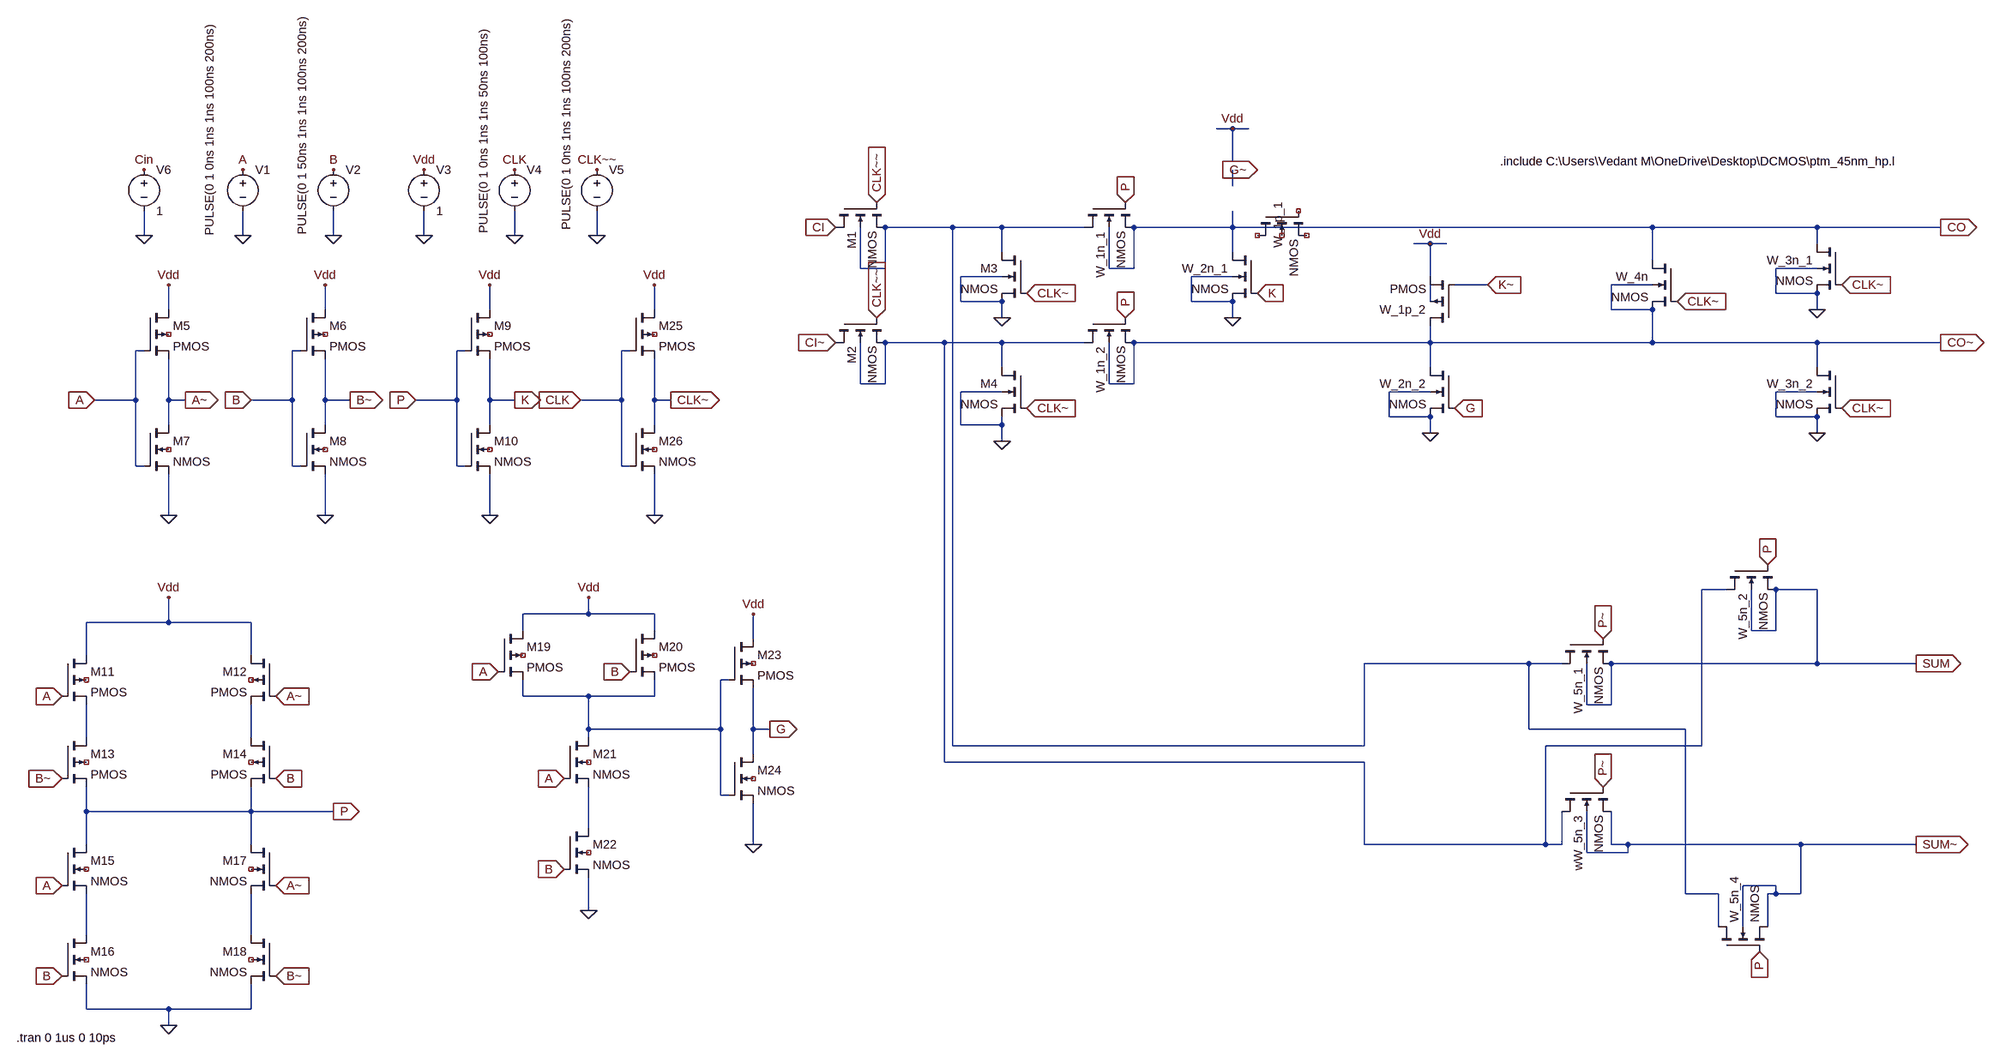
[diagram p0: schematic LVS_Adder_4bit.asc]
LVS_Adder_4bit.asc, the LTspice schematic file:
Version 4
SHEET 1 1592 2052
WIRE -400 -32 -432 -32
WIRE -368 -32 -400 -32
WIRE -400 32 -400 -32
WIRE -400 80 -400 48
WIRE -944 160 -1152 160
WIRE -848 160 -944 160
WIRE -688 160 -848 160
WIRE -400 160 -400 128
WIRE -400 160 -592 160
WIRE 416 160 -400 160
WIRE 736 160 416 160
WIRE 976 160 736 160
WIRE -2592 176 -2592 128
WIRE -2400 176 -2400 128
WIRE -2224 176 -2224 128
WIRE -2048 176 -2048 128
WIRE -1872 176 -1872 128
WIRE -1712 176 -1712 128
WIRE -16 192 -48 192
WIRE 16 192 -16 192
WIRE 736 192 736 160
WIRE -848 208 -848 160
WIRE -400 208 -400 160
WIRE 416 224 416 160
WIRE -1200 240 -1200 160
WIRE -1152 240 -1152 160
WIRE -1152 240 -1200 240
WIRE -640 240 -640 160
WIRE -592 240 -592 160
WIRE -592 240 -640 240
WIRE 736 240 656 240
WIRE -848 256 -928 256
WIRE -400 256 -480 256
WIRE -16 256 -16 192
WIRE 96 272 32 272
WIRE 416 272 336 272
WIRE 656 288 656 240
WIRE 736 288 656 288
WIRE -928 304 -928 256
WIRE -848 304 -928 304
WIRE -480 304 -480 256
WIRE -400 304 -480 304
WIRE -16 304 -16 272
WIRE -2544 320 -2544 272
WIRE -2240 320 -2240 272
WIRE -1920 320 -1920 272
WIRE -1600 320 -1600 272
WIRE 336 320 336 272
WIRE 416 320 336 320
WIRE 736 320 736 288
WIRE -848 336 -848 304
WIRE -400 336 -400 304
WIRE -960 384 -1152 384
WIRE -848 384 -960 384
WIRE -688 384 -848 384
WIRE -16 384 -16 352
WIRE -16 384 -592 384
WIRE 416 384 416 320
WIRE 416 384 -16 384
WIRE 736 384 416 384
WIRE 976 384 736 384
WIRE -2592 400 -2608 400
WIRE -2288 400 -2304 400
WIRE -1968 400 -1984 400
WIRE -1648 400 -1664 400
WIRE -848 432 -848 384
WIRE -16 432 -16 384
WIRE 736 432 736 384
WIRE -1200 464 -1200 384
WIRE -1152 464 -1152 384
WIRE -1152 464 -1200 464
WIRE -640 464 -640 384
WIRE -592 464 -592 384
WIRE -592 464 -640 464
WIRE -848 480 -928 480
WIRE -16 480 -96 480
WIRE 736 480 656 480
WIRE -2608 496 -2608 400
WIRE -2608 496 -2688 496
WIRE -2544 496 -2544 416
WIRE -2512 496 -2544 496
WIRE -2304 496 -2304 400
WIRE -2304 496 -2384 496
WIRE -2240 496 -2240 416
WIRE -2192 496 -2240 496
WIRE -1984 496 -1984 400
WIRE -1984 496 -2064 496
WIRE -1920 496 -1920 416
WIRE -1872 496 -1920 496
WIRE -1664 496 -1664 400
WIRE -1664 496 -1744 496
WIRE -1600 496 -1600 416
WIRE -1568 496 -1600 496
WIRE -96 528 -96 480
WIRE -16 528 -96 528
WIRE 656 528 656 480
WIRE 736 528 656 528
WIRE -2544 544 -2544 496
WIRE -2240 544 -2240 496
WIRE -1920 544 -1920 496
WIRE -1600 544 -1600 496
WIRE -928 544 -928 480
WIRE -848 544 -848 528
WIRE -848 544 -928 544
WIRE -16 560 -16 528
WIRE 736 560 736 528
WIRE -848 576 -848 544
WIRE -2608 624 -2608 496
WIRE -2592 624 -2608 624
WIRE -2304 624 -2304 496
WIRE -2288 624 -2304 624
WIRE -1984 624 -1984 496
WIRE -1968 624 -1984 624
WIRE -1664 624 -1664 496
WIRE -1648 624 -1664 624
WIRE -2544 720 -2544 640
WIRE -2240 720 -2240 640
WIRE -1920 720 -1920 640
WIRE -1600 720 -1600 640
WIRE 560 864 512 864
WIRE 736 864 656 864
WIRE -1728 912 -1728 880
WIRE -1728 912 -1856 912
WIRE -1600 912 -1728 912
WIRE -2544 928 -2544 880
WIRE -2544 928 -2704 928
WIRE -2384 928 -2544 928
WIRE -1856 944 -1856 912
WIRE -1600 944 -1600 912
WIRE 608 944 608 864
WIRE 656 944 656 864
WIRE 656 944 608 944
WIRE -1408 960 -1408 912
WIRE -2704 992 -2704 928
WIRE -2384 992 -2384 928
WIRE 176 1008 -144 1008
WIRE 240 1008 176 1008
WIRE 736 1008 736 864
WIRE 736 1008 336 1008
WIRE 928 1008 736 1008
WIRE -1456 1040 -1472 1040
WIRE -1856 1072 -1856 1040
WIRE -1728 1072 -1856 1072
WIRE -1600 1072 -1600 1040
WIRE -1600 1072 -1728 1072
WIRE 288 1088 288 1008
WIRE 336 1088 336 1008
WIRE 336 1088 288 1088
WIRE -1728 1136 -1728 1072
WIRE -1472 1136 -1472 1040
WIRE -1472 1136 -1728 1136
WIRE -1408 1136 -1408 1056
WIRE -1376 1136 -1408 1136
WIRE 176 1136 176 1008
WIRE 480 1136 176 1136
WIRE -2704 1152 -2704 1088
WIRE -2384 1152 -2384 1088
WIRE -1728 1152 -1728 1136
WIRE -944 1168 -944 160
WIRE -144 1168 -144 1008
WIRE -144 1168 -944 1168
WIRE 512 1168 512 864
WIRE 512 1168 208 1168
WIRE -1408 1184 -1408 1136
WIRE -960 1200 -960 384
WIRE -144 1200 -960 1200
WIRE -1472 1264 -1472 1136
WIRE -1456 1264 -1472 1264
WIRE -2704 1296 -2704 1248
WIRE -2384 1296 -2384 1248
WIRE -2384 1296 -2704 1296
WIRE -2224 1296 -2384 1296
WIRE -1728 1328 -1728 1248
WIRE -2704 1360 -2704 1296
WIRE -2384 1360 -2384 1296
WIRE -1408 1360 -1408 1280
WIRE -144 1360 -144 1200
WIRE 208 1360 208 1168
WIRE 208 1360 -144 1360
WIRE 240 1360 240 1296
WIRE 240 1360 208 1360
WIRE 336 1360 336 1296
WIRE 368 1360 336 1360
WIRE 704 1360 368 1360
WIRE 928 1360 704 1360
WIRE 288 1376 288 1296
WIRE 368 1376 368 1360
WIRE 368 1376 288 1376
WIRE 656 1440 592 1440
WIRE 480 1456 480 1136
WIRE 544 1456 480 1456
WIRE 656 1456 656 1440
WIRE 656 1456 640 1456
WIRE 704 1456 704 1360
WIRE 704 1456 656 1456
WIRE -1728 1488 -1728 1424
WIRE 544 1520 544 1456
WIRE 592 1520 592 1440
WIRE 640 1520 640 1456
WIRE -2704 1536 -2704 1456
WIRE -2384 1536 -2384 1456
WIRE -2704 1680 -2704 1632
WIRE -2544 1680 -2704 1680
WIRE -2384 1680 -2384 1632
WIRE -2384 1680 -2544 1680
WIRE -2544 1712 -2544 1680
FLAG -848 336 0
FLAG -400 336 0
FLAG -16 560 0
FLAG 736 320 0
FLAG 736 560 0
FLAG -848 576 0
FLAG -608 112 P
IOPIN -608 112 In
FLAG 624 1568 P
IOPIN 624 1568 In
FLAG 640 816 P
IOPIN 640 816 In
FLAG 320 960 P~
IOPIN 320 960 In
FLAG 320 1248 P~
IOPIN 320 1248 In
FLAG 976 160 CO
IOPIN 976 160 Out
FLAG 976 384 CO~
IOPIN 976 384 Out
FLAG 928 1008 SUM
IOPIN 928 1008 Out
FLAG 928 1360 SUM~
IOPIN 928 1360 Out
FLAG -1248 160 CI
IOPIN -1248 160 In
FLAG -1248 384 CI~
IOPIN -1248 384 In
FLAG 32 512 G
IOPIN 32 512 In
FLAG -352 48 G~
IOPIN -352 48 In
FLAG -352 288 K
IOPIN -352 288 In
FLAG 96 272 K~
IOPIN 96 272 In
FLAG -1168 112 CLK~~
IOPIN -1168 112 In
FLAG -1168 336 CLK~~
IOPIN -1168 336 In
FLAG -800 512 CLK~
IOPIN -800 512 In
FLAG -800 288 CLK~
IOPIN -800 288 In
FLAG 464 304 CLK~
IOPIN 464 304 In
FLAG 784 272 CLK~
IOPIN 784 272 In
FLAG 784 512 CLK~
IOPIN 784 512 In
FLAG -2400 48 A
FLAG -2224 48 B
FLAG -2544 720 0
FLAG -2240 720 0
FLAG -2048 48 Vdd
FLAG -2544 272 Vdd
FLAG -2240 272 Vdd
FLAG -2688 496 A
IOPIN -2688 496 In
FLAG -2384 496 B
IOPIN -2384 496 In
FLAG -2512 496 A~
IOPIN -2512 496 Out
FLAG -2192 496 B~
IOPIN -2192 496 Out
FLAG -1920 720 0
FLAG -1920 272 Vdd
FLAG -2064 496 P
IOPIN -2064 496 In
FLAG -1872 496 K
IOPIN -1872 496 Out
FLAG -2544 1712 0
FLAG -2544 880 Vdd
FLAG -2752 1072 A
IOPIN -2752 1072 In
FLAG -2752 1440 A
IOPIN -2752 1440 In
FLAG -2752 1232 B~
IOPIN -2752 1232 In
FLAG -2752 1616 B
IOPIN -2752 1616 In
FLAG -2336 1616 B~
IOPIN -2336 1616 In
FLAG -2336 1072 A~
IOPIN -2336 1072 In
FLAG -2336 1440 A~
IOPIN -2336 1440 In
FLAG -2336 1232 B
IOPIN -2336 1232 In
FLAG -2224 1296 P
IOPIN -2224 1296 Out
FLAG -1728 880 Vdd
FLAG -1728 1488 0
FLAG -1904 1024 A
IOPIN -1904 1024 In
FLAG -1776 1232 A
IOPIN -1776 1232 In
FLAG -1648 1024 B
IOPIN -1648 1024 In
FLAG -1776 1408 B
IOPIN -1776 1408 In
FLAG -1408 1360 0
FLAG -1408 912 Vdd
FLAG -1376 1136 G
IOPIN -1376 1136 Out
FLAG -608 336 P
IOPIN -608 336 In
FLAG -400 -32 Vdd
FLAG -16 192 Vdd
FLAG -2400 176 0
FLAG -2224 176 0
FLAG -2048 176 0
FLAG -1872 48 CLK
FLAG -1872 176 0
FLAG -1600 720 0
FLAG -1600 272 Vdd
FLAG -1744 496 CLK
IOPIN -1744 496 In
FLAG -1568 496 CLK~
IOPIN -1568 496 Out
FLAG -1712 48 CLK~~
FLAG -1712 176 0
FLAG -2592 48 Cin
FLAG -2592 176 0
SYMBOL nmos4 -688 112 M90
SYMATTR InstName W_1n_1
SYMATTR Value2 l=45nm w=45nm
SYMBOL nmos4 -352 128 M90
WINDOW 0 -18 41 Left 2
SYMATTR InstName W_1p_1
SYMATTR Value2 l=45nm w=45nm
SYMATTR Value NMOS
SYMATTR Prefix MN
SYMATTR Description N-Channel MOSFET transistor with explicit substrate connection(used for monolithic MOSFETS)
SYMATTR Type nmos4
SYMBOL nmos4 -352 208 M0
SYMATTR InstName W_2n_1
SYMATTR Value2 l=45nm w=90nm
SYMBOL pmos4 32 352 R180
SYMATTR InstName W_1p_2
SYMATTR Value2 l=45nm w=45nm
SYMBOL nmos4 32 432 M0
SYMATTR InstName W_2n_2
SYMATTR Value2 l=45nm w=90nm
SYMBOL nmos4 464 224 M0
SYMATTR InstName W_4n
SYMATTR Value2 l=45nm w=90nm
SYMBOL nmos4 784 192 M0
SYMATTR InstName W_3n_1
SYMATTR Value2 l=45nm w=135nm
SYMBOL nmos4 784 432 M0
SYMATTR InstName W_3n_2
SYMATTR Value2 l=45nm w=135nm
SYMBOL nmos4 560 816 M90
SYMATTR InstName W_5n_2
SYMATTR Value2 l=45nm w=225nm
SYMBOL nmos4 240 960 M90
SYMATTR InstName W_5n_1
SYMATTR Value2 l=45nm w=225nm
SYMBOL nmos4 240 1248 M90
SYMATTR InstName wW_5n_3
SYMATTR Value2 l=45nm w=225nm
SYMBOL nmos4 544 1568 R270
SYMATTR InstName W_5n_4
SYMATTR Value2 l=45nm w=225nm
SYMBOL nmos4 -800 208 M0
SYMATTR InstName M3
SYMATTR Value2 l=45nm w=45nm
SYMBOL nmos4 -800 432 M0
SYMATTR InstName M4
SYMATTR Value2 l=45nm w=45nm
SYMBOL nmos4 -1248 336 M90
SYMATTR InstName M2
SYMATTR Value2 l=45nm w=45nm
SYMBOL nmos4 -1248 112 M90
SYMATTR InstName M1
SYMATTR Value2 l=45nm w=45nm
SYMBOL voltage -2400 32 R0
WINDOW 3 -64 -267 VRight 2
WINDOW 123 0 0 Left 0
WINDOW 39 0 0 Left 0
SYMATTR InstName V1
SYMATTR Value PULSE(0 1 0ns 1ns 1ns 100ns 200ns)
SYMBOL voltage -2224 32 R0
WINDOW 3 -60 -282 VRight 2
WINDOW 123 0 0 Left 0
WINDOW 39 0 0 Left 0
SYMATTR InstName V2
SYMATTR Value PULSE(0 1 50ns 1ns 1ns 100ns 200ns)
SYMBOL pmos4 -2592 320 R0
SYMATTR InstName M5
SYMBOL pmos4 -2288 320 R0
SYMATTR InstName M6
SYMBOL nmos4 -2592 544 R0
SYMATTR InstName M7
SYMBOL nmos4 -2288 544 R0
SYMATTR InstName M8
SYMBOL voltage -2048 32 R0
SYMATTR InstName V3
SYMATTR Value 1
SYMBOL pmos4 -1968 320 R0
SYMATTR InstName M9
SYMBOL nmos4 -1968 544 R0
SYMATTR InstName M10
SYMBOL pmos4 -2752 992 R0
SYMATTR InstName M11
SYMBOL pmos4 -2336 992 M0
SYMATTR InstName M12
SYMBOL pmos4 -2752 1152 R0
SYMATTR InstName M13
SYMBOL pmos4 -2336 1152 M0
SYMATTR InstName M14
SYMBOL nmos4 -2752 1360 R0
SYMATTR InstName M15
SYMBOL nmos4 -2752 1536 R0
SYMATTR InstName M16
SYMBOL nmos4 -2336 1360 M0
SYMATTR InstName M17
SYMBOL nmos4 -2336 1536 M0
SYMATTR InstName M18
SYMBOL pmos4 -1904 944 R0
SYMATTR InstName M19
SYMBOL pmos4 -1648 944 R0
SYMATTR InstName M20
SYMBOL nmos4 -1776 1152 R0
SYMATTR InstName M21
SYMBOL nmos4 -1776 1328 R0
SYMATTR InstName M22
SYMBOL pmos4 -1456 960 R0
SYMATTR InstName M23
SYMBOL nmos4 -1456 1184 R0
SYMATTR InstName M24
SYMBOL nmos4 -688 336 M90
SYMATTR InstName W_1n_2
SYMATTR Value2 l=45nm w=45nm
SYMBOL voltage -1872 32 R0
WINDOW 3 -60 -258 VRight 2
WINDOW 123 0 0 Left 0
WINDOW 39 0 0 Left 0
SYMATTR InstName V4
SYMATTR Value PULSE(0 1 0ns 1ns 1ns 50ns 100ns)
SYMBOL pmos4 -1648 320 R0
SYMATTR InstName M25
SYMBOL nmos4 -1648 544 R0
SYMATTR InstName M26
SYMBOL voltage -1712 32 R0
WINDOW 3 -59 -278 VRight 2
WINDOW 123 0 0 Left 0
WINDOW 39 0 0 Left 0
SYMATTR InstName V5
SYMATTR Value PULSE(0 1 0ns 1ns 1ns 100ns 200ns)
SYMBOL voltage -2592 32 R0
SYMATTR InstName V6
SYMATTR Value 1
TEXT 120 32 Left 2 !.include C:\\Users\\Vedant M\\OneDrive\\Desktop\\DCMOS\\ptm_45nm_hp.l
TEXT -2840 1736 Left 2 !.tran 0 1us 0 10ps

The netlist it stands for:
* LVS_Adder_4bit.asc
M§W_1n_1 N002 P CO CO NMOS l=45nm w=45nm
M§W_1p_1 NC_01 NC_02 NC_03 NC_04 NMOS l=45nm w=45nm
M§W_2n_1 CO K 0 0 NMOS l=45nm w=90nm
M§W_1p_2 CO~ K~ Vdd N003 PMOS l=45nm w=45nm
M§W_2n_2 CO~ G 0 0 NMOS l=45nm w=90nm
M§W_4n CO CLK~ CO~ CO~ NMOS l=45nm w=90nm
M§W_3n_1 CO CLK~ 0 0 NMOS l=45nm w=135nm
M§W_3n_2 CO~ CLK~ 0 0 NMOS l=45nm w=135nm
M§W_5n_2 N004 P SUM SUM NMOS l=45nm w=225nm
M§W_5n_1 N002 P~ SUM SUM NMOS l=45nm w=225nm
M§wW_5n_3 N004 P~ SUM~ SUM~ NMOS l=45nm w=225nm
M§W_5n_4 N002 P SUM~ SUM~ NMOS l=45nm w=225nm
M3 N002 CLK~ 0 0 NMOS l=45nm w=45nm
M4 N004 CLK~ 0 0 NMOS l=45nm w=45nm
M2 CI~ CLK~~ N004 N004 NMOS l=45nm w=45nm
M1 CI CLK~~ N002 N002 NMOS l=45nm w=45nm
V1 A 0 PULSE(0 1 0ns 1ns 1ns 100ns 200ns)
V2 B 0 PULSE(0 1 50ns 1ns 1ns 100ns 200ns)
M5 Vdd A A~ NC_05 PMOS
M6 Vdd B B~ NC_06 PMOS
M7 A~ A 0 NC_07 NMOS
M8 B~ B 0 NC_08 NMOS
V3 Vdd 0 1
M9 Vdd P K NC_09 PMOS
M10 K P 0 NC_10 NMOS
M11 Vdd A N006 NC_11 PMOS
M12 Vdd A~ N007 NC_12 PMOS
M13 N006 B~ P NC_13 PMOS
M14 N007 B P NC_14 PMOS
M15 P A N009 NC_15 NMOS
M16 N009 B 0 NC_16 NMOS
M17 P A~ N010 NC_17 NMOS
M18 N010 B~ 0 NC_18 NMOS
M19 Vdd A N005 NC_19 PMOS
M20 Vdd B N005 NC_20 PMOS
M21 N005 A N008 NC_21 NMOS
M22 N008 B 0 NC_22 NMOS
M23 Vdd N005 G NC_23 PMOS
M24 G N005 0 NC_24 NMOS
M§W_1n_2 N004 P CO~ CO~ NMOS l=45nm w=45nm
V4 CLK 0 PULSE(0 1 0ns 1ns 1ns 50ns 100ns)
M25 Vdd CLK CLK~ NC_25 PMOS
M26 CLK~ CLK 0 NC_26 NMOS
V5 CLK~~ 0 PULSE(0 1 0ns 1ns 1ns 100ns 200ns)
V6 Cin 0 1
.model NMOS NMOS
.model PMOS PMOS
.lib standard.mos
.include C:\Users\Vedant M\OneDrive\Desktop\DCMOS\ptm_45nm_hp.l
.tran 0 1us 0 10ps
.backanno
.end